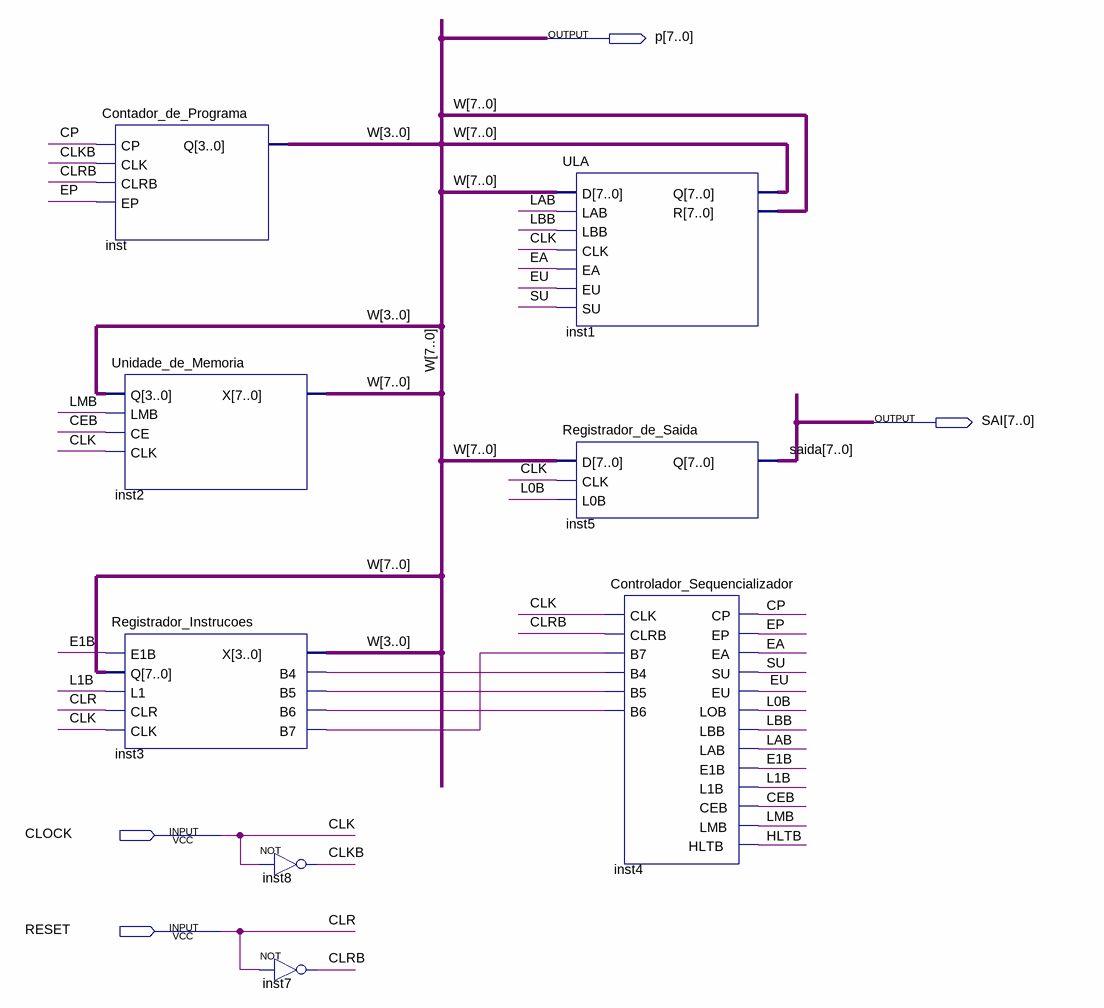
[diagram p0: schematic sheet]
// Quartus schematic Microcomputador.bdf as structural Verilog: 8 symbols, 4 pins
module Microcomputador (
  input  CLOCK,
  input  RESET,
  output [7:0] p,
  output [7:0] SAI
);

  wire CEB, CLKB, CLRB, CP, E1B, EA, EP, EU, HLTB, inst3_b4, inst3_b5, inst3_b6, inst3_b7, L0B, L1B, LAB,
       LBB, LMB, SU;

  Contador_de_Programa inst (.CP(CP), .CLK(CLKB), .CLRB(CLRB), .EP(EP), .Q(p[3:0]));
  Unidade_de_Memoria inst2 (.Q(p[3:0]), .LMB(LMB), .CE(CEB), .CLK(CLOCK), .X(p));
  Registrador_Instrucoes inst3 (
    .E1B(E1B), .Q(p), .L1(L1B), .CLR(RESET), .CLK(CLOCK), .X(p[3:0]), .B4(inst3_b4), .B5(inst3_b5),
    .B6(inst3_b6), .B7(inst3_b7));
  not inst8 (CLKB, CLOCK);
  not inst7 (CLRB, RESET);
  ULA inst1 (.D(p), .LAB(LAB), .LBB(LBB), .CLK(CLOCK), .EA(EA), .EU(EU), .SU(SU), .Q(p), .R(p));
  Registrador_de_Saida inst5 (.D(p), .CLK(CLOCK), .L0B(L0B), .Q(SAI));
  Controlador_Sequencializador inst4 (
    .CLK(CLOCK), .CLRB(CLRB), .B7(inst3_b7), .B4(inst3_b4), .B5(inst3_b5), .B6(inst3_b6), .CP(CP), .EP(EP),
    .EA(EA), .SU(SU), .EU(EU), .LOB(L0B), .LBB(LBB), .LAB(LAB), .E1B(E1B), .L1B(L1B), .CEB(CEB), .LMB(LMB),
    .HLTB(HLTB));

  // Other names for the same wires on the sheet: CLK = CLOCK; W[7:0] = p; CLR = RESET; saida[7:0] = SAI
endmodule
